# Altium project SpectrumAnalyserRecruitProjCallum.PrjPcb
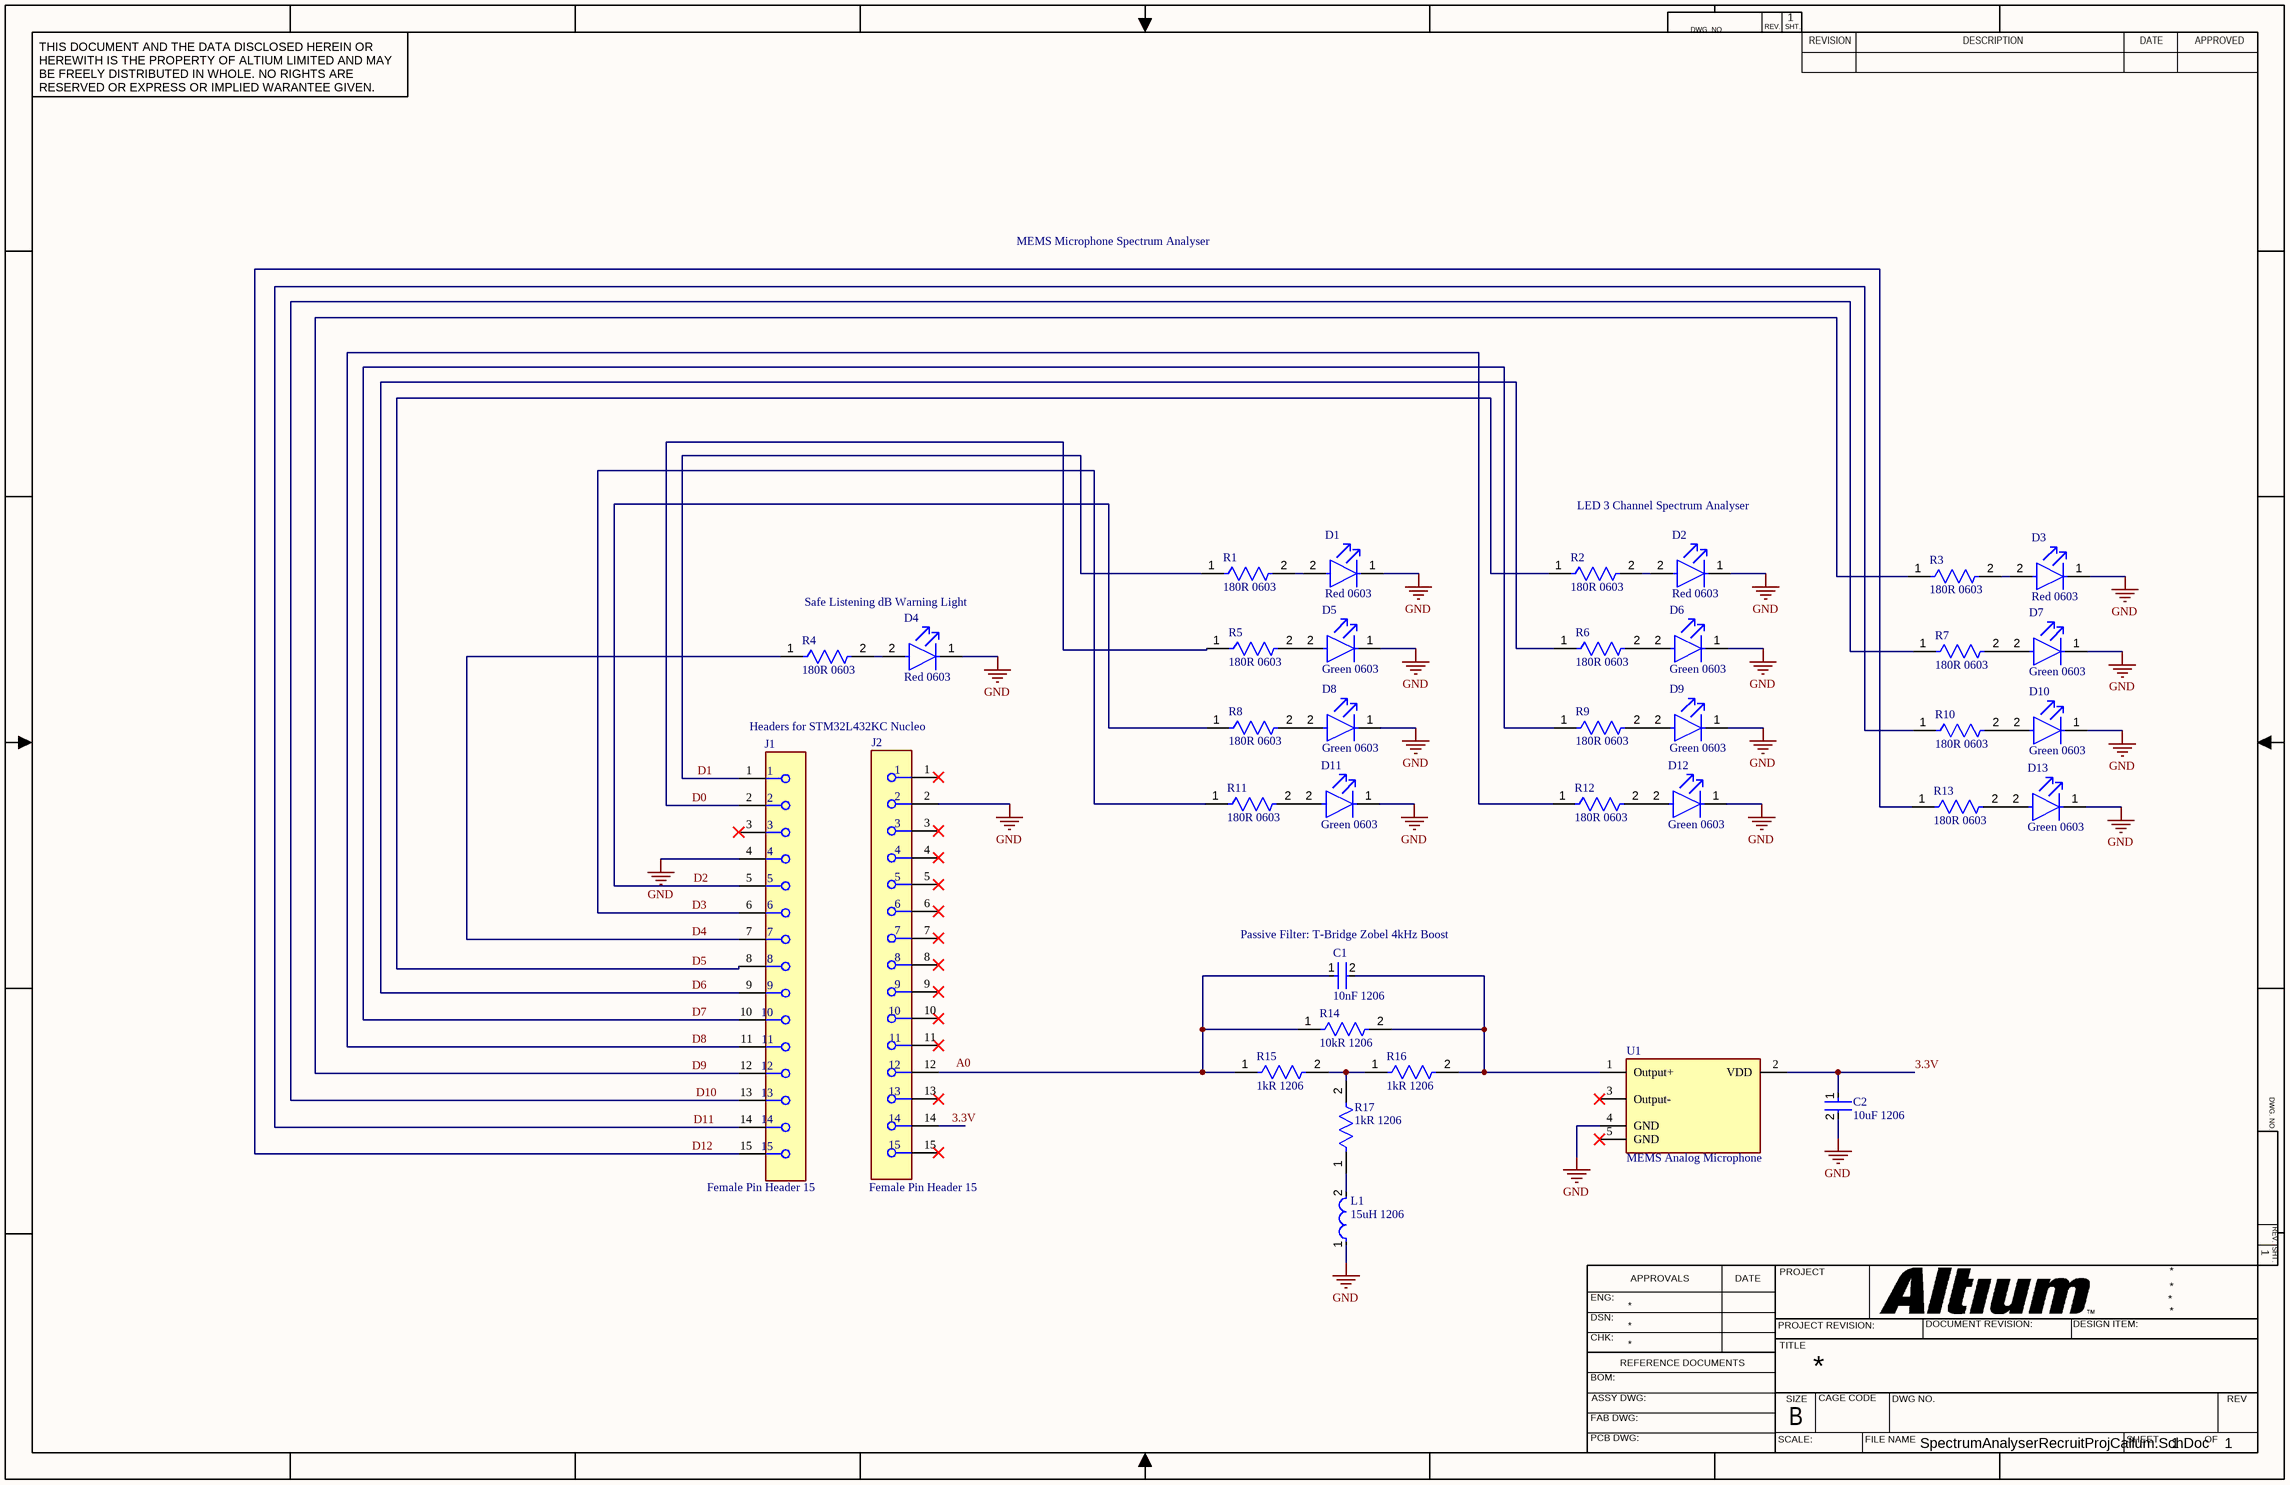
[diagram p0: SpectrumAnalyserRecruitProjCallum.SchDoc]
1 sheet, 36 parts. Net scope: global (net labels, ports and power ports of the same name join across sheets).
Board file: SpectrumAnalyserRecruitProjCallum.PcbDoc

## Sheet SpectrumAnalyserRecruitProjCallum.SchDoc
size 431 x 279 mm; SheetNumber: 1; SheetTotal: 1

### Parts
C1  10nF 1206  [FP-C1206C-EB-MFG]
C2  10uF 1206  [FP-C1206C-EH-MFG]
D1  Red 0603  [FP-SML-LX0603SIW-TR-MFG]
D2  Red 0603  [FP-SML-LX0603SIW-TR-MFG]
D3  Red 0603  [FP-SML-LX0603SIW-TR-MFG]
D4  Red 0603  [FP-SML-LX0603SIW-TR-MFG]
D5  Green 0603  [FP-LG_Q396-MFG]
D6  Green 0603  [FP-LG_Q396-MFG]
D7  Green 0603  [FP-LG_Q396-MFG]
D8  Green 0603  [FP-LG_Q396-MFG]
D9  Green 0603  [FP-LG_Q396-MFG]
D10  Green 0603  [FP-LG_Q396-MFG]
D11  Green 0603  [FP-LG_Q396-MFG]
D12  Green 0603  [FP-LG_Q396-MFG]
D13  Green 0603  [FP-LG_Q396-MFG]
J1  Female Pin Header 15  [FP-SSW-115-01-T-S-MFG]
J2  Female Pin Header 15  [FP-SSW-115-01-T-S-MFG]
L1  15uH 1206  [FP-LQH31CN_03-MFG]
R1  180R 0603  [FP-AF0603-MFG]
R2  180R 0603  [FP-AF0603-MFG]
R3  180R 0603  [FP-AF0603-MFG]
R4  180R 0603  [FP-AF0603-MFG]
R5  180R 0603  [FP-AF0603-MFG]
R6  180R 0603  [FP-AF0603-MFG]
R7  180R 0603  [FP-AF0603-MFG]
R8  180R 0603  [FP-AF0603-MFG]
R9  180R 0603  [FP-AF0603-MFG]
R10  180R 0603  [FP-AF0603-MFG]
R11  180R 0603  [FP-AF0603-MFG]
R12  180R 0603  [FP-AF0603-MFG]
R13  180R 0603  [FP-AF0603-MFG]
R14  10kR 1206  [FP-RMCF1206-MFG]
R15  1kR 1206  [FP-RMCF1206-IPC_A]
R16  1kR 1206  [FP-RMCF1206-IPC_A]
R17  1kR 1206  [FP-RMCF1206-IPC_A]
U1  MEMS Analog Microphone  [FP-PG-LLGA-5-MFG]

### Nets
GND: C2.2 D1.1(C) D2.1(C) D3.1(C) D4.1(C) D5.1(C) D6.1(C) D7.1(C) D8.1(C) D9.1(C) D10.1(C) D11.1(C) D12.1(C) D13.1(C) J1.4 J2.2 L1.1 U1.4(GND)
3.3V: C2.1 J2.14 U1.2(VDD)
D0: J1.2 R5.1
D1: J1.1 R1.1
D2: J1.5 R8.1
D3: J1.6 R11.1
D4: J1.7 R4.1
D5: J1.8 R2.1
D6: J1.9 R6.1
D7: J1.10 R9.1
D8: J1.11 R12.1
D9: J1.12 R3.1
D10: J1.13 R7.1
D11: J1.14 R10.1
D12: J1.15 R13.1
NetC1_1: C1.1 J2.12 R14.1 R15.1
NetC1_2: C1.2 R14.2 R16.2 U1.1(Output+)
NetD1_2: D1.2(A) R1.2
NetD2_2: D2.2(A) R2.2
NetD3_2: D3.2(A) R3.2
NetD4_2: D4.2(A) R4.2
NetD5_2: D5.2(A) R5.2
NetD6_2: D6.2(A) R6.2
NetD7_2: D7.2(A) R7.2
NetD8_2: D8.2(A) R8.2
NetD9_2: D9.2(A) R9.2
NetD10_2: D10.2(A) R10.2
NetD11_2: D11.2(A) R11.2
NetD12_2: D12.2(A) R12.2
NetD13_2: D13.2(A) R13.2
NetL1_2: L1.2 R17.1
NetR15_2: R15.2 R16.1 R17.2

Not connected (* = marked no-connect by the designer): J1 3*; J2 1* 3* 4* 5* 6* 7* 8* 9* 10* 11* 13* 15*; U1 3(Output-)* 5(GND)*

### Notes on the sheet
- MEMS Microphone Spectrum Analyser
- LED 3 Channel Spectrum Analyser
- Safe Listening dB Warning Light
- Headers for STM32L432KC Nucleo
- (near C1) Passive Filter: T-Bridge Zobel 4kHz Boost
- Labels drawn without touching a wire or pin: A0
- DWG. NO.
- REV.
- SHT.
- THIS DOCUMENT AND THE DATA DISCLOSED HEREIN OR HEREWITH IS THE PROPERTY OF ALTIUM LIMITED AND MAY BE FREELY DISTRIBUTED IN WHOLE. NO RIGHTS ARE RESERVED OR EXPRESS OR IMPLIED WARANTEE GIVEN.
- REVISION
- DESCRIPTION
- DATE
- APPROVED
- ENG:
- APPROVALS
- PROJECT
- DSN:
- CHK:
- REFERENCE DOCUMENTS
- PROJECT REVISION:
- TITLE
- DOCUMENT REVISION:
- DESIGN ITEM:
- BOM:
- FAB DWG:
- PCB DWG:
- ASSY DWG:
- SCALE:
- SIZE
- B
- CAGE CODE
- FILE NAME
- DWG NO.
- SHEET
- OF
- REV

### Library data of the parts
C1 = CMP-03020-033994-1: C1206 10,000 pF C0G 5.00% 50 V; Manufacturer: KEMET; Manufacturer Part Number: C1206C103J5GACAUTO; Material: Ceramic; Temperature Coefficient: 15%; Automotive Grade: Grade 0; Voltage Rating: 50 V; Tolerance: 0.05; Value: 10,000 pF; Height: 0.88mm; Octopart: https://octopart.com/c1206c103j5gacauto-kemet-88376196; Device Class L2: Capacitors; Device Class L1: Passive Components; Temperature Characteristic: C0G; Package: C1206C-EB; Temperature Range High: +150°C; ComponentLink2Description: Datasheet; Temperature: -55°C to +150°C; Lead Free: Yes; Ipc Land Pattern Name: CAPC320160X78; RoHS: TRUE; Temperature Range Low: -55°C; ComponentLink2URL: https://content.kemet.com/datasheets/KEM_C1007_X8R_ULTRA_150C_SMD.pdf; Device Class L3: Ceramic Capacitors; Category: Cap; Capacitance: 10,000 pF; Automotive: Yes
C2 = CMP-03020-003375-1: CAP CER 10UF 16V X7R 1206C1206C106K4RACAUTO; Manufacturer: Kemet; Material: Ceramic; Temperature Coefficient: 15%; Tolerance: 10%; Automotive Grade: Grade 1; Manufacturer Part Number: C1206C106K4RACAUTO; Digikey Description: CAP CER 10UF 16V X7R 1206; RoHS: TRUE; Temperature Range Low: -55°C; Ipc Land Pattern Name: CAPC320160X160; Category: Cap; Mouser Description: Multilayer Ceramic Capacitors MLCC - SMD/SMT 10uF 16V 10% AUTO; Device Class L1: Passive Components; Automotive: Yes; ComponentLink2Description: Datasheet; Octopart: https://octopart.com/c1206c106k4racauto-kemet-20072893; Package: C1206C-EH; Temperature: -55°C to +125°C; Device Class L3: Ceramic Capacitors; Device Class L2: Capacitors; Temperature Range High: +125°C; Capacitance: 10uF; Value: 10uF; Lead Free: Yes; Height: 1.8mm; Temperature Characteristic: X7R; ComponentLink2URL: https://content.kemet.com/datasheets/KEM_C1023_X7R_AUTO_SMD.pdf; Voltage Rating: 16V
D1-D4 = CMP-57192-000009-1: LED RED DIFFUSED SMD; Test Current: 20mA; Forward Voltage: 2V; Approvals: UL; Dominant Wavelength: 636nm; Viewing Angle: 140°; Lens Color: White; Luminous Intensity: 60mcd; Power Rating: 50mW; Number of LEDs: 1; Color: Red; Forward Current: 20mA; Moisture Sensitivity Level: 2; Case Code (Imperial): 0603; Lead Free: Lead Free; Lens Transparency: Diffused; Case Code (Metric): 1608; Height: 0.6mm; Max Operating Temperature: 85°C; Width: 0.8mm; Lens Style: Diffused; Illumination Color: Red; Wavelength: 636nm; REACH SVHC: No SVHC; Package Quantity: 1; RoHS Compliant: Yes; Case/Package: 0603; Number of Pins: 2; Packaging: Tape and Reel; Length: 1.6mm; Mount: Surface Mount; Min Operating Temperature: -25°C
D5-D13 = CMP-62016-000069-1: LED GREEN DIFFUSED 0603 SMD; Lens Color: White; Wavelength: 573nm; Test Current: 20mA; Luminous Intensity: 163mcd; Lens Style: Flat; Lens Size: 0.8mm; Forward Voltage: 2V; Viewing Angle: 120°; Height: 0.4mm; Color: Green; Mount: Surface Mount; Case Code (Metric): 1608; Lens Transparency: Diffused; REACH SVHC: No SVHC; Length: 1.6mm; Width: 0.8mm; Dominant Wavelength: 573nm; RoHS Compliant: Yes; Case/Package: 0603; Case Code (Imperial): 0603; Packaging: Tape and Reel; Forward Current: 20mA
J1 J2 = CMP-02766-001723-1: CONN RCPT 15POS 0.1 TIN PCB; Connector Type: Receptacle; Max Voltage Rating (AC): 550V; Mating Cycles: 100; Number of Positions: 15; Pitch: 0.1inch; Max Current Rating: 6.9A; Contact Resistance: 10mR; Contact Type: Female Socket; Color: Black; Depth: 2.41mm; Radiation Hardening: No; Orientation: Straight; Termination: Solder; Series: SSW; Lead Free: Lead Free; Min Operating Temperature: -55°C; Contact Plating: Tin; Contact Material: Bronze; Max Operating Temperature: 105°C; Mount: Through Hole; Packaging: Bulk; Gender: Receptacle; Housing Material: Polymer; RoHS Compliant: Yes; Length: 38.61mm; Number of Rows: 1; REACH SVHC: No SVHC; Width: 2.41mm; Number of Contacts: 15; Housing Color: Black
L1 = CMP-06042-008727-1: Wire Wound Ferrite Inductor for General Circuits 15μH ±5% 3.9Ω 90mA 1206; Shielding: Unshielded; Q Factor: 35; DC Resistance (DCR): 3R; Test Frequency: 1MHz; Self Resonant Frequency: 16MHz; Radiation Hardening: No; Military Standard: Not; Lead Free: Lead Free; Length: 0.126inch; Depth: 1.8mm; Packaging: Tape and Reel; Resistor Type: Wirewound; DC Current: 90mA; Package Quantity: 2000; Height: 1.8mm; Termination: SMD/SMT; Case Code (Imperial): 1206; Inductance: 15uH; Case/Package: 1206; Weight: 0.001023oz; Core Material: Ferrite; Tolerance: 5%; Min Operating Temperature: -40°C; Case Code (Metric): 3216; Max DC Current: 90mA; Height - Seated (Max): 0.078inch; Mount: Surface Mount; Current Rating: 90mA; Width: 0.063inch; Max Operating Temperature: 85°C
R1-R13 = CMP-03412-044825-1: Anti-Sulfurated Chip Resistors Automotive Grade 180Ω 1% 100ppm/°C 0603; Max Power Dissipation: 100mW; Features: Moisture Resistant; Width: 0.031inch; Number of Terminations: 2; Case/Package: 0603; Temperature Coefficient: 100ppm/°C; Length: 0.063inch; Series: AF; Tolerance: 1%; Max Operating Temperature: 155°C; Resistance: 180R; Height: 0.022inch; RoHS Compliant: Yes; Resistor Type: Thick Film; Packaging: Tape and Reel; Min Operating Temperature: -55°C
R14 = CMP-26527-002036-1: 10kΩ ±1% 0.25W 1206 Thick Film Chip Resistor AEC-Q200 compliant; Max Power Dissipation: 250mW; Temperature Coefficient: 100ppm/°C; Construction: Rectangular; Contact Plating: Tin; Max Operating Temperature: 155°C; Features: Automotive AEC-Q200; Radiation Hardening: No; Military Standard: Not; RoHS Compliant: Yes; Length: 0.126inch; Resistance: 10kR; Number of Terminations: 2; Mount: Surface Mount; Case Code (Imperial): 1206; Case Code (Metric): 3216; Series: RMCF; Width: 0.063inch; Min Operating Temperature: -55°C; Height: 0.028inch; Resistor Type: Thick Film; Packaging: Tape and Reel; Tolerance: 1%; Depth: 1.6mm; Case/Package: 1206
R15-R17 = CMP-26527-006126-1: 1kΩ ±5% 0.25W 1206 Thick Film Chip Resistor AEC-Q200 compliant; Max Power Dissipation: 250mW; Temperature Coefficient: 200ppm/°C; Resistor Type: Thick Film; Height: 0.028inch; Max Operating Temperature: 155°C; Resistance: 1kR; Features: Automotive AEC-Q200; Case/Package: 1206; Mount: Surface Mount; Series: RMCF; Min Operating Temperature: -55°C; Packaging: Tape and Reel; Contact Plating: Tin; Length: 0.126inch; Number of Terminations: 2; Radiation Hardening: No; Width: 0.063inch; Case Code (Metric): 3216; Case Code (Imperial): 1206; RoHS Compliant: Yes; Tolerance: 5%
U1 = CMP-32934-000001-1: MICROPHONES_DIFFERENTIAT PG-LLGA IM73A135V01XTSA1